# Altium project DE-130418.PrjPcb
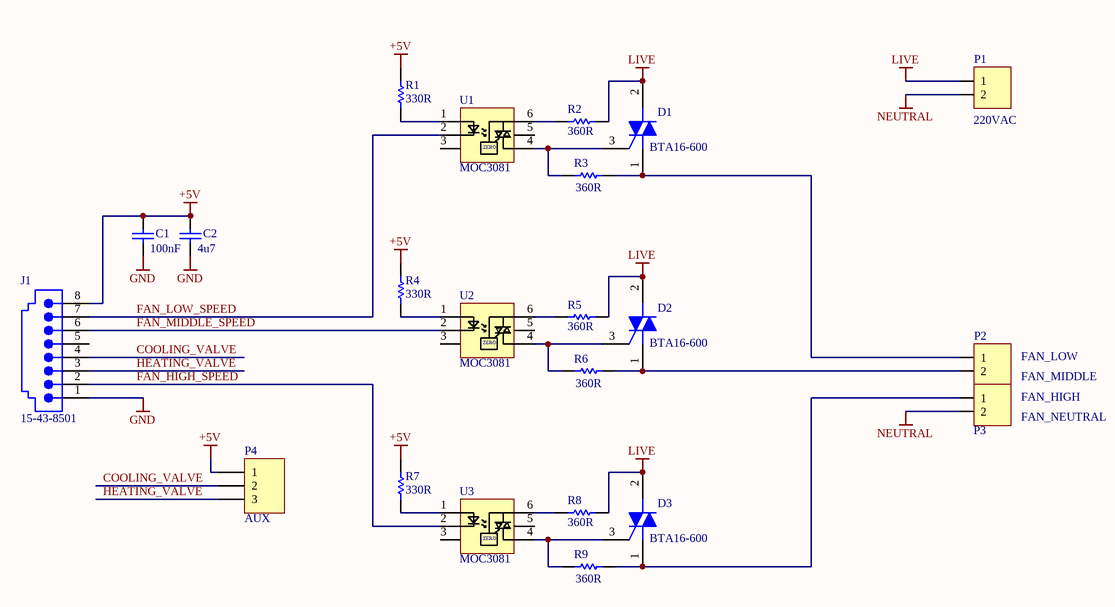
[diagram p0: DE-130418.SchDoc]
1 sheet, 22 parts. Net scope: global (net labels, ports and power ports of the same name join across sheets).
Board file: DE-130418.PcbDoc

## Sheet DE-130418.SchDoc: FANCOIL INTERFACE
size A4; Author: eldar6776@hotmail.com; DrawnBy: Eldar Dedic; Organization: I-MEDIA GROUP d.o.o.; Address1: Topal Osman Paše 18; Address2: Sarajevo 71000; Address3: Federacija BiH; Address4: Bosna i Hercegovina; DocumentNumber: DE-130418; Revision: 001

### Parts
C1  100nF  [0603]
C2  4u7  [0805]
D1  BTA16-600  [ONSC-TO-220-3-221A-07]
D2  BTA16-600  [ONSC-TO-220-3-221A-07]
D3  BTA16-600  [ONSC-TO-220-3-221A-07]
J1  15-43-8501  [15-43-8501]
P1  220VAC  [TERMINAL BLOK 2]
P2  (no value)  [TERMINAL BLOK 2]
P3  (no value)  [TERMINAL BLOK 2]
P4  AUX  [HDR1X3]
R1  330R  [ERA-0805]
R2  360R  [RD6.35x2.3]
R3  360R  [RD6.35x2.3]
R4  330R  [ERA-0805]
R5  360R  [RD6.35x2.3]
R6  360R  [RD6.35x2.3]
R7  330R  [ERA-0805]
R8  360R  [RD6.35x2.3]
R9  360R  [RD6.35x2.3]
U1  MOC3081  [DIP6]
U2  MOC3081  [DIP6]
U3  MOC3081  [DIP6]

### Nets
+5V: C1.2 C2.2 J1.8 P4.1 R1.2 R4.2 R7.2
GND: C1.1 C2.1 J1.1
LIVE: D1.2(MT2) D2.2(MT2) D3.2(MT2) P1.1 R2.2 R5.2 R8.2
NEUTRAL: P1.2 P3.2
COOLING_VALVE: J1.4 P4.2
FAN_HIGH_SPEED: J1.2 U3.2
FAN_LOW_SPEED: J1.7 U1.2
FAN_MIDDLE_SPEED: J1.6 U2.2
HEATING_VALVE: J1.3 P4.3
NetD1_1: D1.1(MT1) P2.1 R3.2
NetD1_3: D1.3(G) R3.1 U1.4
NetD2_1: D2.1(MT1) P2.2 R6.2
NetD2_3: D2.3(G) R6.1 U2.4
NetD3_1: D3.1(MT1) P3.1 R9.2
NetD3_3: D3.3(G) R9.1 U3.4
NetR1_1: R1.1 U1.1
NetR2_1: R2.1 U1.6
NetR4_1: R4.1 U2.1
NetR5_1: R5.1 U2.6
NetR7_1: R7.1 U3.1
NetR8_1: R8.1 U3.6

Not connected (* = marked no-connect by the designer): J1 5; U1 3 5; U2 3 5; U3 3 5

### Notes on the sheet
- FAN_LOW
- FAN_MIDDLE
- FAN_HIGH
- FAN_NEUTRAL
- Title
- Size:
- Date:
- A4
- Number:
- Time:
- Revision:
- Sheet
- of
- File:
- (in symbol MOC3081) ZERO

### Library data of the parts
C1 = C0603: Ceramic Chip Capacitor - Standard; Note: Footprint corresponds to dimensions for bulk cassette packaging. This case size has tightened tolerances.; Published: 17-Jul-2002; LatestRevisionDate: 19-Mar-2004; LatestRevisionNote: Silkscreen size reduced.; DatasheetDocument: Mar-2001; PackageDocument: Mar-2001; PackageReference: 0603; Publisher: Altium Limited; Code_JEITA: 0603; Code_IPC: 1608 [0603]; ComponentLink1Description: Manufacturer Link; ComponentLink1URL: http://www.kemet.com/; ComponentLink2Description: Datasheet; ComponentLink2URL: http://www.kemet.com/kemet/web/homepage/kechome.nsf/vapubfilesname/F3102TA.pdf/$file/F3102TA.pdf; Value: 100nF
C2 = C0805: Ceramic Chip Capacitor - Standard; Note: Footprint corresponds to dimensions for bulk cassette packaging. This case size has tightened tolerances.; Published: 17-Jul-2002; LatestRevisionDate: 19-Mar-2004; LatestRevisionNote: Silkscreen size reduced.; DatasheetDocument: Mar-2001; PackageDocument: Mar-2001; PackageReference: 0805; Publisher: Altium Limited; Code_JEITA: 0805; Code_IPC: 2012[0805]; ComponentLink1Description: Manufacturer Link; ComponentLink1URL: http://www.kemet.com/; ComponentLink2Description: Datasheet; ComponentLink2URL: http://www.kemet.com/kemet/web/homepage/kechome.nsf/vapubfilesname/F3102TA.pdf/$file/F3102TA.pdf; Value: 4u7
D1-D3 = BTA08-600BW3G: Triacs, Silicon Bidirectional Thyristor, 3-Pin TO-220, Pb-Free, Tube; Manufacturer: On Semiconductor; IGT Max (mA): 50; IT(RMS) Max (A): 8; ITSM Max (A): 90; DatasheetVersion: Rev. 1; PackageVersion: Rev. O, 07/2008; PackageReference: TO-220-3-221A-07; PackageDescription: 3-Pin Flange Mount, Vertical Straight Lead, Body 9.97 x 4.445 mm, Pitch 2.54 mm; Supplier 1: Digi-Key; Supplier Part Number 1: BTA08-600BW3G-ND; Supplier 2: Newark; Supplier Part Number 2: 13P2072; Supplier 3: Mouser; Supplier Part Number 3: 863-BTA08-600BW3G; Packing: Tube; RoHS: Pb-Free; Mounting Technology: Through Hole; PartNumber: BTA08-600BW3G; ComponentLink1Description: Manufacturer URL; ComponentLink1URL: http://www.onsemi.com/; ComponentLink2Description: Datasheet; ComponentLink2URL: http://www.onsemi.com/pub_link/Collateral/BTA08-600BW3-D.PDF; ComponentLink3Description: Package Specification; ComponentLink3URL: http://www.onsemi.com/pub_link/Collateral/221A-07.PDF
J1 = 15-43-8501: Right Angle, Standard Profile, RJ-45 Keyed, Unshielded PCB Jack; Ports: 1; Positions/Loaded: Port1 - 8 Keyed/8; PerformanceCategory: 3; PCB_Mounting: Thru-Hole; DrillSize: Nominal, Rounded to nearest 0.05mm; PCB_Layout: Complies with Manufacturer's Recommendation.; Published: 25-Jun-2002; DatasheetDocument: 18-Dec-2001; PackageDocument: 18-Dec-2001; PackageReference: 15-43-8501; Publisher: Altium Limited; ComponentLink1Description: Manufacturer Link; ComponentLink1URL: http://www.molex.com/; ComponentLink2Description: Datasheet; ComponentLink2URL: http://www.molex.com/cmc_upload/common_files/1212003_41687catalogpage.pdf; ComponentLink3Description: Iges Model; ComponentLink3URL: http://www.molex.com/pdm_docs/igs/15-43-8501_igs.zip
P1-P3 = TERMINAL BLOK 2: Terminal blok konektor 5 mm
P4 = Header 3: Header, 3-Pin; LatestRevisionDate: 17-Jul-2002; LatestRevisionNote: Re-released for DXP Platform.; Publisher: Altium Limited
R1 R4 R7 = ERAS: Metal Film Thermosensitive Chip Resistor, 0.56 Ohm to 10k Ohm Range, 5% Tolerance, 0805 Size, 0.1 W; Note: If flow soldering, adjust pad width of PCB Footprint to 0.7 - 0.8 times the width of the resistor.; Published: 17-Dec-2003; LatestRevisionDate: 19-Mar-2004; LatestRevisionNote: Silkscreen size reduced.; PackageDocument: Mar-2003; PackageReference: ERA-0805; Publisher: Altium Limited; Code_IPC: 2012 [0805]; ComponentLink1Description: Manufacturer Link; ComponentLink1URL: http://www.panasonic.com/industrial/components/resistive_products.htm; ComponentLink2Description: Datasheet; ComponentLink2URL: http://www.panasonic.com/industrial/components/pdf/AOF0000CE1.pdf
R2 R3 R5 R6 R8 R9 = ERDS1T: Carbon Film Resistor, 1 Ohm to 3.3M Ohm Range, 5% Tolerance, 0.5 W; Published: 17-Dec-2003; PackageReference: RD6.35x2.3; Publisher: Altium Limited; ComponentLink1Description: Manufacturer Link; ComponentLink1URL: http://www.panasonic.com/industrial/components/resistive_products.htm; ComponentLink2Description: Datasheet; ComponentLink2URL: http://www.panasonic.com/industrial/components/pdf/AOA0000CE12.pdf
U1-U3 = MOC3081: Zero-Cross Optoisolator Triac Driver